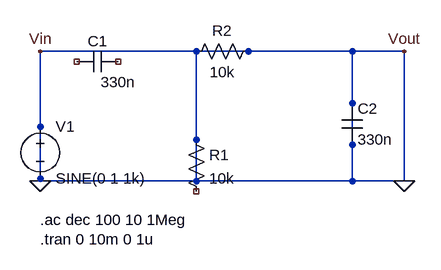
[diagram p0: schematic 06_circuit_generated-by-claude-sonnet-4-6.asc]
06_circuit_generated-by-claude-sonnet-4-6.asc, the LTspice schematic file:
Version 4
SHEET 1 880 680
WIRE 80 200 80 400
WIRE 80 200 160 200
WIRE 80 400 640 400
WIRE 160 200 240 200
WIRE 240 200 320 200
WIRE 320 200 320 400
WIRE 320 200 400 200
WIRE 400 200 480 200
WIRE 480 200 560 200
WIRE 560 200 560 400
WIRE 560 200 640 200
WIRE 640 200 640 400
FLAG 80 400 0
FLAG 640 200 Vout
FLAG 640 400 0
FLAG 80 200 Vin
SYMBOL voltage 80 300 R0
SYMATTR InstName V1
SYMATTR Value SINE(0 1 1k)
SYMATTR SpiceLine AC 1
SYMBOL cap 200 200 R90
WINDOW 0 0 32 VBottom 2
WINDOW 3 32 0 VTop 2
SYMATTR InstName C1
SYMATTR Value 330n
SYMBOL res 304 320 R0
SYMATTR InstName R1
SYMATTR Value 10k
SYMBOL res 416 184 R90
WINDOW 0 0 56 VBottom 2
WINDOW 3 32 56 VTop 2
SYMATTR InstName R2
SYMATTR Value 10k
SYMBOL cap 544 280 R0
SYMATTR InstName C2
SYMATTR Value 330n
TEXT 80 460 Left 2 !.ac dec 100 10 1Meg
TEXT 80 490 Left 2 !.tran 0 10m 0 1u

The netlist it stands for:
* 06_circuit_generated-by-claude-sonnet-4-6.asc
V1 0 0 SINE(0 1 1k) AC 1
C1 NC_01 NC_02 330n
R1 0 NC_03 10k
R2 0 0 10k
C2 0 0 330n
.ac dec 100 10 1Meg
.tran 0 10m 0 1u
.backanno
.end